# EAGLE design focuser-1.6 (EAGLE 6.3)
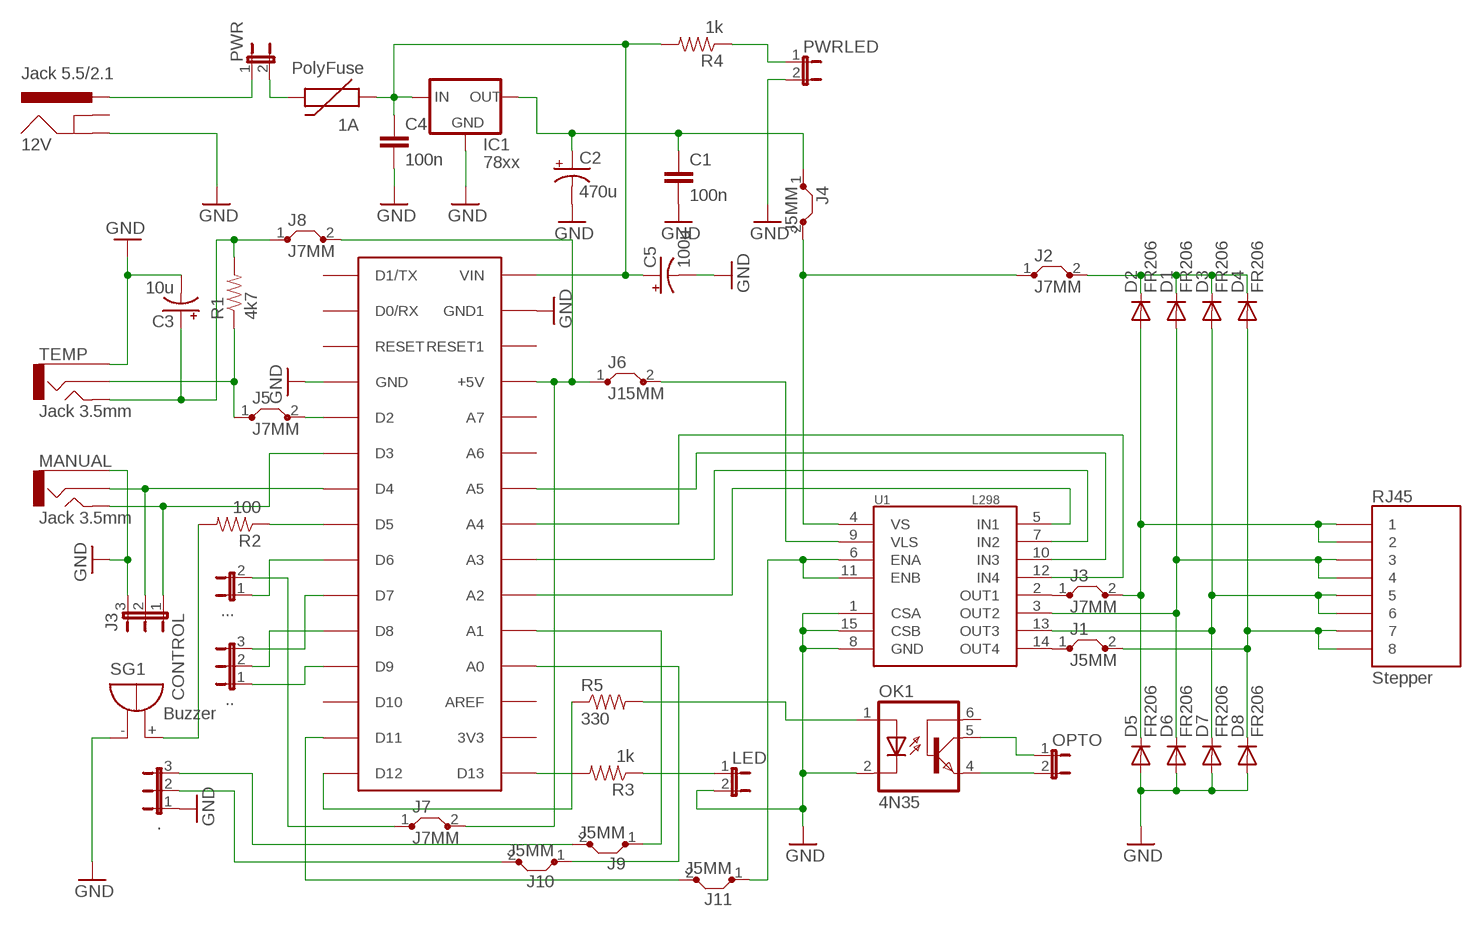
[diagram p0: schematic, sheet 1]

## Parts
1A  PolyFuse  PTCPTH  [PTC]
12V  Jack 5.5/2.1  POWER_JACKCOMBO  [POWER_JACK_COMBO]
.  JUMPER-3PTH  [1X03]
..  JUMPER-3PTH  [1X03]
...  JUMPER-2PTH  [1X02]
C1  100n  CAP_  [AXIAL-5MM]
C2  470u  CAP_POLPTH1  [CPOL-RADIAL-100UF-25V]
C3  10u  CAP_POLPTH1  [CPOL-RADIAL-100UF-25V]
C4  100n  CAP_  [AXIAL-5MM]
C5  100u  CAP_POLPTH1  [CPOL-RADIAL-100UF-25V]
CONTROL  J3  JUMPER-3PTH  [1X03]
D1  FR206  DIODEPTH  [DIODE-1N4001]
D2  FR206  DIODEPTH  [DIODE-1N4001]
D3  FR206  DIODEPTH  [DIODE-1N4001]
D4  FR206  DIODEPTH  [DIODE-1N4001]
D5  FR206  DIODEPTH  [DIODE-1N4001]
D6  FR206  DIODEPTH  [DIODE-1N4001]
D7  FR206  DIODEPTH  [DIODE-1N4001]
D8  FR206  DIODEPTH  [DIODE-1N4001]
IC1  78xx  V_REG_78XXSINK  [TO220-IGO]
J1  J5MM  [05]
J2  J7MM  [07]
J3  J7MM  [07]
J4  J5MM  [05]
J5  J7MM  [07]
J6  J15MM  [15]
J7  J7MM  [07]
J8  J7MM  [07]
J9  J5MM  [05]
J10  J5MM  [05]
J11  J5MM  [05]
LED  JUMPER-2PTH  [1X02]
MANUAL  Jack 3.5mm  AUDIO-JACKPTH  [AUDIO-JACK]
OK1  4N35  [DIL06]
OPTO  JUMPER-2PTH  [1X02]
PWR  JUMPER-2PTH  [1X02]
PWRLED  JUMPER-2PTH  [1X02]
R1  4k7  RESISTORPTH1  [AXIAL-0.3]
R2  100  RESISTORPTH1  [AXIAL-0.3]
R3  1k  RESISTORPTH1  [AXIAL-0.3]
R4  1k  RESISTORPTH1  [AXIAL-0.3]
R5  330  RESISTORPTH1  [AXIAL-0.3]
RJ45  Stepper  RJ45-8PTH  [RJ45-8]
SG1  Buzzer  F/QMBIII  [F/QMBIII]
TEMP  Jack 3.5mm  AUDIO-JACKPTH  [AUDIO-JACK]
U1  L298  [MULTIWATT15]
U$1  ARDUINONANO  [PDIP-32]

## Nets
+5: J6.1 J7.2 J8.2 U$1.+5V
GND [power]: 12V.GND@1(GND) ..1 C1.P$2 C2.2(-) C3.2(-) C4.P$2 C5.2(-) CONTROL.3 D5.A D6.A D7.A D8.A IC1.GND LED.2 MANUAL.1 OK1.2(C) PWRLED.2 SG1.-(+) TEMP.1 U1.1(CSA) U1.8(GND) U1.15(CSB) U$1.GND U$1.GND1
N$1: R2.P$2 SG1.+(-)
N$2: J6.2 U1.9(VLS)
N$3: J11.2 U$1.D11
N$4: U1.10(IN3) U$1.A2(A5)
N$5: U1.7(IN2) U$1.A4(A3)
N$6: ....2 J7.1
N$7 [power]: 1A.P$2 PWR.2
N$8: ....1 U$1.D6
N$9 [power]: 1A.P$1 C4.P$1 C5.1(+) IC1.IN R4.P$2 U$1.VIN
N$10 [power]: D4.A D8.C J1.2 RJ45.7 RJ45.8
N$11: J1.1 U1.14(OUT4)
N$12: R5.P$1 U$1.D12
N$13: U1.12(IN4) U$1.A3(A4)
N$14 [power]: D1.A D6.C RJ45.3 RJ45.4 U1.3(OUT2)
N$15: J11.1 U1.6(ENA) U1.11(ENB)
N$16 [power]: D2.A D5.C J3.2 RJ45.1 RJ45.2
N$17: J5.1 R1.P$1 TEMP.2
N$18: CONTROL.2 MANUAL.2 U$1.D4
N$19: J5.2 U$1.D2
N$20 [power]: PWRLED.1 R4.P$1
N$21 [power]: D3.A D7.C RJ45.5 RJ45.6 U1.13(OUT3)
N$22 [power]: D1.C D2.C D3.C D4.C J2.2
N$23: J3.1 U1.2(OUT1)
N$24: CONTROL.1 MANUAL.5 U$1.D3
N$25: ..2 J10.2
N$27 [power]: J2.1 J4.2 U1.4(VS)
N$28: R3.P$2 U$1.D13
N$29: LED.1 R3.P$1
N$30: C3.1(+) J8.1 R1.P$2 TEMP.5
N$31: ..3 J9.2
N$32: ...3 U$1.D7
N$33: ...2 U$1.D8
N$34: ...1 U$1.D9
N$35: R2.P$1 U$1.D5
N$36: J9.1 U$1.A6(A1)
N$37: OK1.1(A) R5.P$2
N$38: OK1.4(EMI) OPTO.2
N$39: OK1.5(COL) OPTO.1
N$40: 12V.POWER(PWR) PWR.1
N$41: J10.1 U$1.A7(A0)
N$42: U1.5(IN1) U$1.A5(A2)
VCC2 [power]: C1.P$1 C2.1(+) IC1.OUT J4.1
Unconnected: 12V.GND(GNDBREAK) OK1.6(BAS) U$1.3V3 U$1.A0(A7) U$1.A1(A6) U$1.AREF U$1.D0/RX U$1.D1/TX U$1.D10 U$1.RESET U$1.RESET1

## Library data of the parts
1A = SparkFun:PTC: Resettable Fuse PTC Resettable Fuse. Spark Fun Electronics SKU : COM-08357
12V = SparkFun:POWER_JACK: Power Jack This is the standard 5.5mm barrel jack for power. The PTH is the most common, proven, reliable, footprint. All others are experimental. The Slot footprint only works if the mill layer is transmitted to the PCB fab house so be warned. Spark Fun Electronics SKU : PRT-00119. Mating wall wart : TOL-00298 (and others)
. .. CONTROL = SparkFun:JUMPER-3
... LED OPTO PWR PWRLED = SparkFun:JUMPER-2: Jumper Basic 0.1" spaced jumper. Use with breakaway headers.
C1 C4 = SparkFun:CAP: Capacitor Standard 0603 ceramic capacitor, and 0.1" leaded capacitor.
C2 C3 C5 = SparkFun:CAP_POL: Capacitor Polarized These are standard SMD and PTH capacitors. Normally 10uF, 47uF, and 100uF in electrolytic and tantalum varieties. Always verify the external diameter of the through hole cap, it varies with capacity, voltage, and manufacturer. The EIA devices should be standard.
D1-D8 = SparkFun:DIODE: Diode These are standard reverse protection diodes and small signal diodes. SMA package can handle up to about 1A. SOD-323 can handle about 200mA. What the SOD-323 package when ordering, there are some mfgs out there that are 5-pin packages.
IC1 = SparkFun:V_REG_78XX: Voltage Regulator Standard 7805 5V regulator. IGO (Input Ground Output). Spark Fun Electronics SKU : COM-00107
J1-J11 = jumper:J: Bridge
MANUAL TEMP = SparkFun:AUDIO-JACK: 3.5mm Audio Jack Simple 3.5mm common PCB mount audio jack. SKU: PRT-08032
OK1 = optocoupler:4N35: MOTOROLA OPTO COUPLER; MF: FAIRCHILD SEMICONDUCTOR; MPN: 4N35; OC_FARNELL: 1328375; OC_NEWARK: 72K9946
R1-R5 = SparkFun:RESISTOR: Resistor Basic schematic elements and footprints for 0603, 1206, and PTH 1/10th watt (small) resistors.
RJ45 = SparkFun:RJ45-8: RJ45 Jack Simple RJ45, 8-pin connection - connector for common Cat5, Cat5e, and Cat6 Ethernet cables. Footprint not yet proven in production. Connector sku is PRT-00643; Breakout PCB sku is BOB-00716.
SG1 = buzzer:F/QMBIII: BUZZER Source: Buerklin; OC_FARNELL: unknown; OC_NEWARK: unknown
U1 = SparkFun:L298: L298 Dual Full Bridge Driver
U$1 = jet-lib:ARDUINONANO

## Net classes
0 default: width 0.254 mm, drill 0.635 mm, clearance 0.203 mm
1 power: width 0.254 mm, drill 0.635 mm, clearance 0.203 mm

## Board
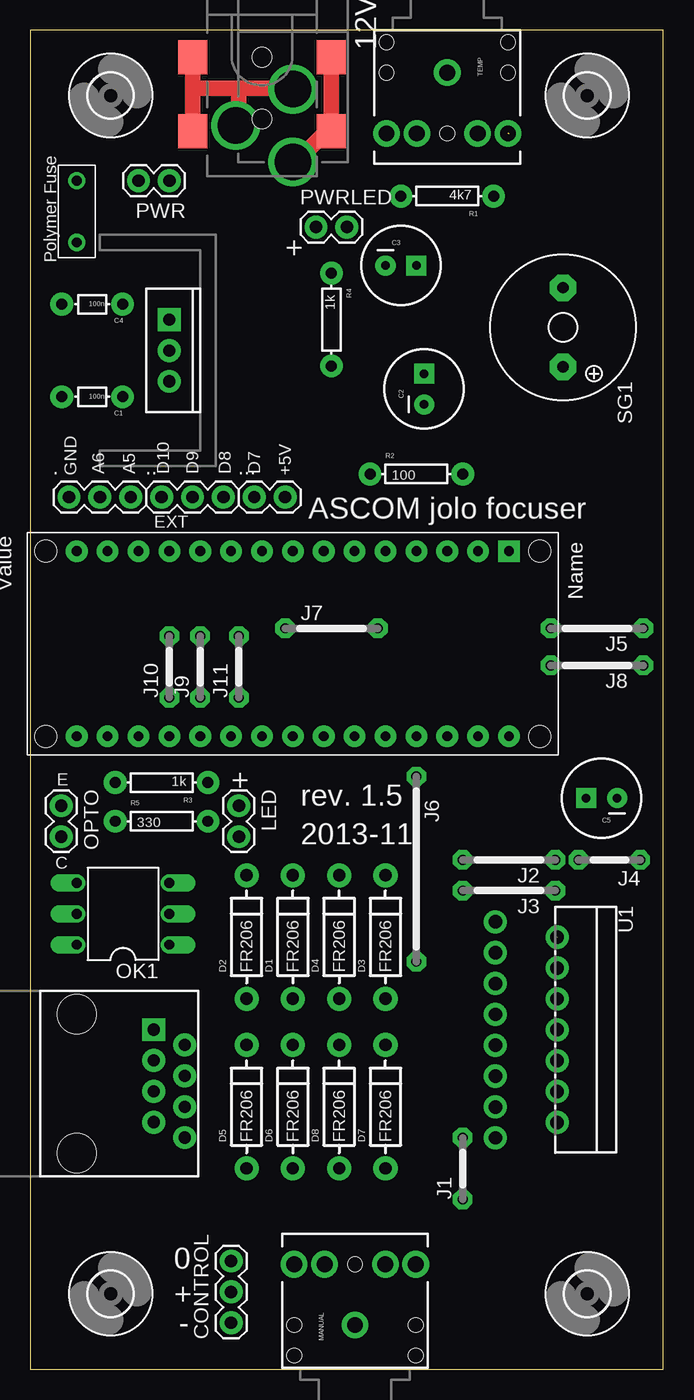
[diagram p1: board, top side]
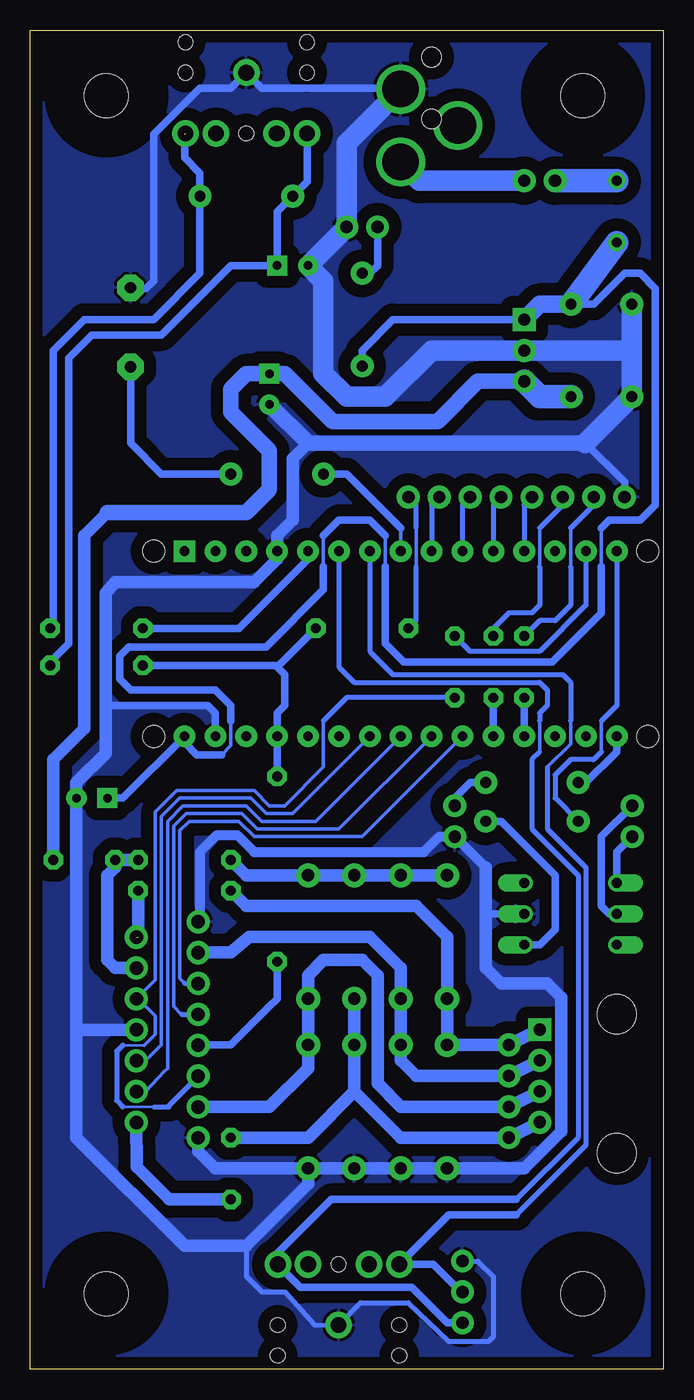
[diagram p2: board, bottom side, seen from below]

Size 52.05 x 110.16 mm. Coordinates in mm from the lower left corner, seen from the top.
Outline: 0,0 52.05,0 52.05,110.16 0,110.16 0,0
Copper layers (1*16): Top 0.035mm / dielectric 1.5mm / Bottom 0.035mm
Design rules "SparkFun": minimum track width 8mil, minimum drill 20mil, track to track 8mil, track to pad 8mil, pad to pad 8mil, via to via 8mil, smd to smd 8mil, copper to edge 10mil, drill to drill 8mil, minimum pad ring 12mil, minimum via ring 10mil, stop-mask expansion 4mil, vias tented up to drill 25mil, thermal gap 10mil

### Footprints (pad centres in the part's own frame; a part is rotated, then mirrored left to right if it is on the bottom)
PTC = drill 0.8: P$1 -2.54,0; P$2 2.54,0
POWER_JACK_COMBO = drill 2.997: GND 5.62,-2.16; GND@1 2.62,2.54; POWER 8.62,2.54 | smd 2.8 x 2.4: GND@3 0,-5.7; GND@4 6.1,-5.7; POWER@1 0,5.7; POWER@2 6.1,5.7 | hole 1.6: 0,0; 5.08,0
1X03 = drill 1.016 pad 1.88: 1 0,0; 2 2.54,0; 3 5.08,0
1X02 = drill 1.016 pad 1.88: 1 0,0; 2 2.54,0
AXIAL-5MM = drill 0.9 pad 1.88: P$1 -2.5,0; P$2 2.5,0
CPOL-RADIAL-100UF-25V = drill 0.7 pad 1.651 square: 1 1.27,0 | drill 0.7 pad 1.651: 2 -1.27,0
DIODE-1N4001 = drill 1 pad 1.981: A -5.08,0; C 5.08,0
TO220-IGO = drill 1 pad 1.88: GND 0,0; OUT 2.54,0 | drill 1 pad 1.88 square: IN -2.54,0
05 = drill 0.813 pad 1.6 octagon: 1 -2.54,0; 2 2.54,0
07 = drill 0.813 pad 1.6 octagon: 1 -3.81,0; 2 3.81,0
15 = drill 0.813 pad 1.6 octagon: 1 -7.62,0; 2 7.62,0
AUDIO-JACK = drill 1.3 pad 2.184: 1 0,0; 2 5,5; 3 5,2.5; 4 5,-2.5; 5 5,-5 | hole 1.2: 0,5; -2.5,5; -2.5,-5; 0,-5; 5,0
DIL06 = drill 0.813 offset: 1 -2.54,-3.81; 2 0,-3.81; 3 2.54,-3.81; 4 2.54,3.81; 5 0,3.81; 6 -2.54,3.81
AXIAL-0.3 = drill 0.9 pad 1.88: P$1 -3.81,0; P$2 3.81,0
RJ45-8 = drill 1 pad 1.88 square: 1 -4.445,6.35 | drill 1 pad 1.88: 2 -3.175,8.89; 3 -1.905,6.35; 4 -0.635,8.89; 5 0.635,6.35; 6 1.905,8.89; 7 3.175,6.35; 8 4.445,8.89 | hole 3.2: -5.715,0; 5.715,0
F/QMBIII = drill 0.914 pad 2.159 octagon: + 3.251,0; - -3.251,0
MULTIWATT15 = drill 1.1 pad 1.9: 1 -8.95,-2.39; 2 -7.68,2.69; 3 -6.41,-2.39; 4 -5.14,2.69; 5 -3.87,-2.39; 6 -2.6,2.69; 7 -1.33,-2.39; 8 -0.06,2.69; 9 1.21,-2.39; 10 2.48,2.69; 11 3.75,-2.39; 12 5.02,2.69; 13 6.29,-2.39; 14 7.56,2.69; 15 8.83,-2.39
PDIP-32 = drill 0.8 pad 1.778: 3V3 15.24,-35.56; +5V 15.24,-10.16; A0 15.24,-12.7; A1 15.24,-15.24; A2 15.24,-17.78; A3 15.24,-20.32; A4 15.24,-22.86; A5 15.24,-25.4; A6 15.24,-27.94; A7 15.24,-30.48; AREF 15.24,-33.02; D0/RX 0,-5.08; D2 0,-12.7; D3 0,-15.24; D4 0,-17.78; D5 0,-20.32; D6 0,-22.86; D7 0,-25.4; D8 0,-27.94; D9 0,-30.48; D10 0,-33.02; D11 0,-35.56; D12 0,-38.1; D13 15.24,-38.1; GND 0,-10.16; GND1 15.24,-5.08; RESET 0,-7.62; RESET1 15.24,-7.62; VIN 15.24,-2.54 | drill 0.8 pad 1.778 square: D1/TX 0,-2.54 | hole 1.778: 0,0; 0,-40.64; 15.24,-40.64; 15.24,0
3,6 = hole 3.6: 0,0

### Placement (x,y rotation side)
1A  3.81,95.25 90 top
12V  19.05,107.95 270 top
.  3.17,71.75 0 top
..  10.79,71.75 0 top
...  18.41,71.75 0 top
C1  5.08,80.01 180 top
C2  32.38,80.64 90 top
C3  30.48,90.81 0 top
C4  5.08,87.63 180 top
C5  46.99,46.99 180 top
CONTROL  16.51,3.81 90 top
D1  21.59,35.56 90 top
D2  17.78,35.56 90 top
D3  29.21,35.56 90 top
D4  25.4,35.56 90 top
D5  17.78,21.59 90 top
D6  21.59,21.59 90 top
D7  29.21,21.59 90 top
D8  25.4,21.59 90 top
IC1  11.43,83.82 270 top
J1  35.56,16.51 90 top
J2  39.37,41.91 180 top
J3  39.37,39.37 180 top
J4  47.62,41.91 180 top
J5  46.61,60.96 180 top
J6  31.75,41.15 270 top
J7  24.77,60.96 0 top
J8  46.61,57.91 180 top
J9  13.97,57.78 90 top
J10  11.43,57.78 90 top
J11  17.14,57.78 90 top
LED  17.14,46.35 270 top
MANUAL  26.7,3.63 90 top
OK1  7.62,37.47 90 top
OPTO  2.54,46.35 270 top
PWR  11.43,97.79 180 top
PWRLED  23.5,93.98 0 top
R1  34.29,96.52 180 top
R2  31.75,73.66 0 top
R3  10.79,48.26 180 top
R4  24.77,86.36 270 top
R5  10.79,45.09 0 top
RJ45  3.81,23.5 270 top
SG1  43.81,85.72 270 top
TEMP  34.29,106.68 270 top
U1  40.64,27.86 270 top
U$1  41.91,67.31 270 top
U$2  [3,6]  6.6,6.2 0 top
U$3  [3,6]  45.8,6.2 0 top
U$4  [3,6]  45.8,104.8 0 top
U$5  [3,6]  6.6,104.8 0 top

### Tracks (layer width: path | path; a pad name or v marks a point on that pad's centre or on a via)
+5
  Bottom 0.406: 31.88,57.91 31.75,57.78
  Bottom 0.61: J8.2 31.88,57.91 | J7.2 31.75,57.78 31.11,57.15 31.11,54.61 31.75,53.98 U$1.+5V J6.1
GND
  Bottom 0.406: CONTROL.3 15.24,8.89 13.97,7.62 13.97,2.67 14.35,2.29 17.65,2.29 20.95,5.46 24.89,5.46 MANUAL.1 28.7,3.63 31.11,6.35 33.02,6.35 34.29,7.62 34.29,10.16 | 43.74,88.9 SG1.- | 21.67,105.41 12V.GND@1
  Bottom 0.61: 21.67,105.41 33.02,105.41 TEMP.1 35.56,105.41 38.1,105.41 41.91,101.6 41.91,89.53 42.55,88.9 43.74,88.9 | 45.85,54.61 37.47,54.61 36.83,53.98 U$1.GND1 | OK1.2 14.61,37.47 | 6.39,76.2 3.17,72.98 ..1
  Bottom 0.813: 38.1,36.83 38.1,42.55 36.7,43.94 35.05,43.94 33.66,42.55 19.68,42.55 18.41,43.81 LED.2 14.61,41.27
  Bottom 1.016: U1.15 38.25,17.93 36.83,16.51 D7.A | 48.26,27.94 C5.2 48.26,48.26 45.85,50.67 45.85,54.61 45.85,63.88 45.09,64.77 33.66,64.77 31.75,66.67 U$1.GND 31.75,68.58 30.48,69.85 30.48,74.93 29.21,76.2 | 48.26,27.94 48.26,19.05 39.37,10.16 34.29,10.16 29.21,15.24 D7.A | U1.8 48.24,27.92 48.26,27.94 | 14.61,41.27 14.61,37.47 14.61,33.02 13.34,31.75 9.53,31.75 8.38,30.61 8.38,19.56 11.43,16.51 D5.A D6.A D8.A D7.A
  Bottom 1.27: C2.2 29.21,76.2 6.39,76.2
  Bottom 1.676: 2.58,83.82 C1.P$2 6.39,76.2 | 2.58,83.82 C4.P$2 | 2.58,83.82 IC1.GND 19.05,83.82 22.86,80.01 26.04,80.01 27.94,81.92 27.94,89.53 C3.2 PWRLED.2 26.04,100.89 12V.GND@1
  pour Bottom (isolate 1.016): 0,109.86 52.07,109.86 52.07,0 0,0
N$1
  Bottom 0.61: R2.P$2 41.27,73.66 43.81,76.2 SG1.+
N$2
  Bottom 0.305: 38.23,26.67 U1.9
  Bottom 0.61: 38.23,26.67 35.56,26.67 32.38,29.84 31.75,30.48 J6.2
N$3
  Bottom 0.406: U$1.D11 6.35,62.87 10.16,59.05 15.88,59.05 J11.2
N$4
  Bottom 0.305: U1.10 43.31,25.4 42.55,25.4 41.27,26.67 41.27,45.47 39.75,46.99 33.91,46.99 32.64,45.72 30.48,45.72 U$1.A2
N$5
  Bottom 0.305: 39.62,29.21 40.26,29.84 40.26,44.7 39.24,45.72 34.67,45.72 33.4,44.45 26.67,44.45 U$1.A4 | 38.27,29.21 U1.7
  Bottom 0.406: 39.62,29.21 38.27,29.21
N$6
  Bottom 0.305: 20.32,66.04 20.32,69.22
  Bottom 0.406: J7.1 20.32,61.59 20.32,66.04 | 20.32,69.22 20.32,71.12 ....2
N$7
  Bottom 1.93: 1A.P$2 PWR.2
N$8
  Bottom 0.406: ....1 19.05,71.12 U$1.D6
N$9
  Bottom 0.305: 36.32,50.55 35.56,51.31 35.56,53.34 | 27.94,66.04 27.94,68.58 | 22.86,68.58 22.86,66.04 | 5.08,66.04 5.08,69.22
  Bottom 0.61: C5.1 44.45,46.99 U$1.VIN 39.37,51.56 38.35,50.55 36.32,50.55 | 27.94,66.04 27.94,64.14 32.64,59.44 43.94,59.44 44.7,58.67 44.7,56.77 43.81,55.88 36.83,55.88 35.56,54.61 35.56,53.34 | 27.94,68.58 26.67,69.85 24.13,69.85 22.86,68.58 | C4.P$1 5.71,87.63 3.17,90.17 1.91,90.17 0.64,88.9 0.64,71.12 1.91,69.85 4.45,69.85 5.08,69.22 | R4.P$2 24.77,83.82 22.23,86.36 IC1.IN | 22.86,66.04 22.86,59.69 21.34,58.17 9.14,58.17 5.08,62.23 5.08,66.04
  Bottom 1.422: C4.P$1 10.16,87.63 IC1.IN
  Bottom 1.93: 1A.P$1 C4.P$1
N$10
  Bottom 1.016: RJ45.7 RJ45.8 21.59,19.05 25.4,22.86 | 25.4,22.86 29.21,19.05 J1.2 | D4.A D8.C 25.4,22.86
N$11
  Bottom 1.016: J1.1 40.64,13.97 43.31,16.64 U1.14
N$12
  Bottom 0.305: 5.08,53.34 5.08,50.8
  Bottom 0.406: U$1.D12 3.81,54.61 5.08,53.34 | 5.08,50.8 5.71,50.16 7.62,50.16 8.89,48.9 8.89,46.99 R5.P$1
N$13
  Bottom 0.305: 40.77,24.77 41.02,24.49 | 41.02,24.49 42.55,22.86 43.31,22.86 U1.12 | U$1.A3 28.57,45.09 33.02,45.09 34.29,46.35 39.5,46.35 40.77,45.09 40.77,24.75 41.02,24.49
N$14
  Bottom 0.406: 38.23,34.29 U1.3
  Bottom 1.016: RJ45.3 RJ45.4 19.05,24.13 20.32,24.13 21.59,25.4 D6.C D1.A 21.59,33.02 24.13,35.56 34.04,35.56 35.56,34.29 38.23,34.29
N$15
  Bottom 0.203: 42.67,26.64 44.45,26.64 | 44.46,21.57 41.91,21.59 41.89,21.57
  Bottom 0.254: 40.64,21.57 40.64,21.72
  Bottom 0.305: 42.67,26.64 41.78,27.56 41.78,29.08 43.16,30.46 U1.6 41.78,32.01 41.78,45.85 40.01,47.62 33.66,47.62 32.38,46.35 31.11,46.35 27.94,49.53 27.94,53.34
  Bottom 0.406: 44.45,26.64 44.96,26.16 44.96,22.1 44.46,21.57 | 41.89,21.57 40.64,21.57 | 40.64,21.72 U1.11 | J11.1 26.04,55.24 27.94,53.34
N$16
  Bottom 1.016: RJ45.1 RJ45.2 D5.C D2.A 17.78,35.56 20.32,38.1 34.29,38.1 J3.2
N$17  (1 unrouted)
  Bottom 0.406: 50.16,61.21 J5.1
  Bottom 0.61: 39.37,101.6 39.37,99.69 38.1,98.42 R1.P$1 38.1,90.17 41.91,86.36 47.62,86.36 50.16,83.82 50.16,61.21
N$18
  Bottom 0.305: 7.62,53.34 7.62,51.44 9.53,49.53
  Bottom 0.406: CONTROL.2 16.67,6.35 16.67,6.38 | 12.06,12.7 6.35,18.41 6.35,41.27 9.53,44.45 9.53,49.53 | U$1.D4 24.13,59.05 22.23,57.15 8.26,57.15 7.62,56.52 7.62,53.34
  Bottom 0.61: 16.67,6.38 18.92,8.64 MANUAL.2 17.63,12.7 12.06,12.7
N$19
  Bottom 0.406: 29.21,66.67 U$1.D2
  Bottom 0.61: 29.21,66.67 34.92,60.96 J5.2
N$20
  Bottom 0.61: R4.P$1 24.13,90.17 23.5,90.81 PWRLED.1
N$21
  Bottom 0.406: 38.23,21.59 U1.13
  Bottom 1.016: RJ45.5 RJ45.6 21.59,21.59 23.5,23.5 23.5,32.38 24.77,33.66 27.94,33.66 29.21,32.38 D3.A D7.C 29.21,24.77 32.38,21.59 38.23,21.59
N$22
  Bottom 1.016: D2.C D1.C D4.C D3.C 34.29,40.64 J2.2
N$23  (1 unrouted)
  Bottom 1.016: J3.1 43.18,35.56
N$24
  Bottom 0.305: 10.16,53.34 10.16,50.8
  Bottom 0.406: 12.06,13.97 6.99,19.05 6.99,40.64 10.79,44.45 10.79,50.16 10.16,50.8 | MANUAL.5 31.75,8.63 | U$1.D3 26.67,57.78 25.4,56.52 10.16,56.52 9.53,55.88 9.53,54.61 10.16,53.98 10.16,53.34
  Bottom 0.61: CONTROL.1 17.78,3.81 20.7,6.73 29.84,6.73 30.61,7.46 MANUAL.5 | 12.06,13.97 27.3,13.97 31.75,9.53 31.75,8.63
N$25
  Bottom 0.305: 7.62,69.22 7.62,66.04
  Bottom 0.406: ..2 5.71,71.12 7.62,69.22 | 7.62,66.04 7.62,62.87 8.89,61.59 10.16,61.59 J10.2
N$27
  Bottom 0.406: J4.2 45.09,41.27 | 43.35,33.02 U1.4
  Bottom 1.016: J2.1 J4.2 | 45.09,41.27 45.72,40.64 45.72,33.66 45.09,33.02 43.35,33.02
N$28
  Bottom 0.61: R3.P$2 6.35,48.26 3.81,50.8 U$1.D13
N$29
  Bottom 0.61: LED.1 17.14,46.99 15.88,48.26 R3.P$1
N$30
  Bottom 0.406: J8.1 50.42,58.17
  Bottom 0.61: TEMP.5 29.29,97.71 R1.P$2 31.75,95.25 C3.1 35.56,90.81 41.27,85.09 46.99,85.09 48.9,83.19 48.9,59.69 50.42,58.17
N$31
  Bottom 0.305: 10.16,69.22 10.16,66.04
  Bottom 0.406: ..3 8.26,71.12 10.16,69.22 | 10.16,66.04 10.16,62.87 10.79,62.23 12.7,62.23 13.97,60.96 J9.2
N$32
  Bottom 0.406: ...3 16.51,71.12 U$1.D7
N$33
  Bottom 0.406: ...2 13.97,71.12 U$1.D8
N$34
  Bottom 0.406: ...1 11.43,71.12 U$1.D9
N$35
  Bottom 0.305: U$1.D5 21.59,69.22
  Bottom 0.61: 21.59,69.22 26.04,73.66 R2.P$1
N$36
  Bottom 0.61: U$1.A6 J9.1
N$37
  Bottom 0.61: R5.P$2 13.34,45.09 8.89,40.64 8.89,36.2 10.16,34.92 OK1.1
N$38
  Bottom 0.61: OK1.4 3.81,42.55 OPTO.2
N$39
  Bottom 0.61: OPTO.1 5.08,43.81 5.08,38.1 4.45,37.47 OK1.5
N$40
  Bottom 1.676: PWR.1 20.05,97.79 12V.POWER
N$41
  Bottom 0.61: J10.1 U$1.A7
N$42
  Bottom 0.305: 39.37,31.75 39.75,32.13 39.75,44.32 38.99,45.09 34.92,45.09 33.66,43.81 24.77,43.81 U$1.A5 | 38.27,31.75 U1.5
  Bottom 0.406: 39.37,31.75 38.27,31.75
VCC2
  Bottom 1.016: J4.1 50.16,50.16 47.62,52.7 47.62,68.58 45.72,70.48
  Bottom 1.27: IC1.OUT 15.24,81.28 18.54,77.98 27.18,77.98 31.11,81.92 C2.1 34.29,81.92 35.56,80.64 35.56,78.74 32.38,75.56 32.38,72.39 34.29,70.48 45.72,70.48
  Bottom 1.93: C1.P$1 10.16,80.01 IC1.OUT

### Text on the board
tNames: Polymer Fuse | + | GND | A6 | A5 | D10 | D9 | D8 | D7 | +5V | ASCOM jolo focuser | EXT | E | + | rev. 1.5 | 2013-11 | C | 0 | + | -